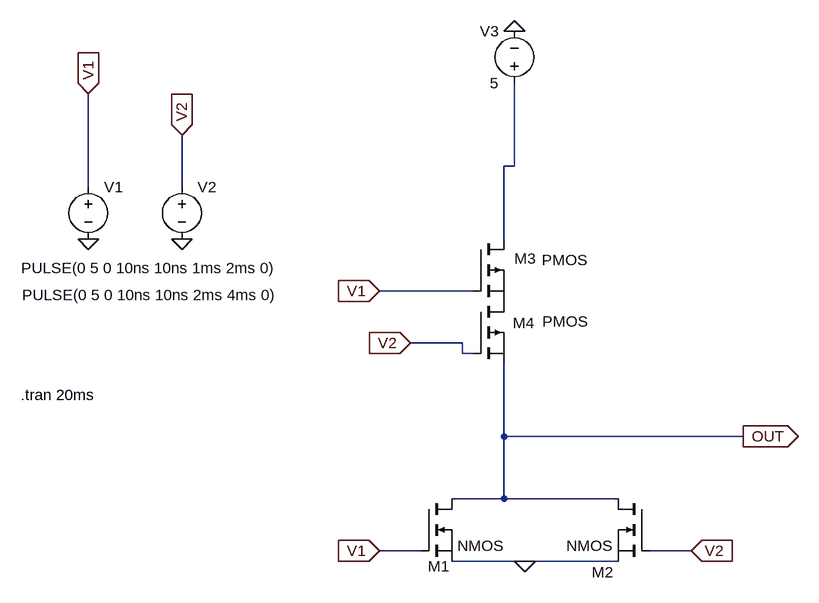
[diagram p0: schematic NOR.asc]
NOR.asc, the LTspice schematic file:
Version 4
SHEET 1 1348 992
WIRE 464 128 464 0
WIRE 464 128 448 128
WIRE -192 160 -192 16
WIRE -48 160 -48 80
WIRE 448 240 448 128
WIRE 400 320 256 320
WIRE 384 400 304 400
WIRE 384 416 384 400
WIRE 400 416 384 416
WIRE 448 544 448 432
WIRE 816 544 448 544
WIRE 448 640 448 544
WIRE 448 640 368 640
WIRE 624 640 448 640
WIRE 320 720 256 720
WIRE 736 720 672 720
WIRE 480 736 368 736
WIRE 624 736 480 736
FLAG -48 240 0
FLAG -192 240 0
FLAG 816 544 OUT
IOPIN 816 544 Out
FLAG -192 16 V1
IOPIN -192 16 In
FLAG 256 320 V1
IOPIN 256 320 In
FLAG -48 80 V2
IOPIN -48 80 In
FLAG 304 400 V2
IOPIN 304 400 In
FLAG 256 720 V1
IOPIN 256 720 In
FLAG 736 720 V2
IOPIN 736 720 In
FLAG 464 -80 0
FLAG 480 736 0
SYMBOL voltage -192 144 R0
WINDOW 3 -103 141 Left 2
WINDOW 123 0 0 Left 0
WINDOW 39 0 0 Left 0
SYMATTR Value PULSE(0 5 0 10ns 10ns 1ms 2ms 0)
SYMATTR InstName V1
SYMBOL voltage -48 144 R0
WINDOW 3 -246 182 Left 2
WINDOW 123 0 0 Left 0
WINDOW 39 0 0 Left 0
SYMATTR Value PULSE(0 5 0 10ns 10ns 2ms 4ms 0)
SYMATTR InstName V2
SYMBOL pmos 400 336 R0
WINDOW 0 -69 408 Left 2
WINDOW 3 107 31 Left 2
SYMATTR InstName M1
SYMBOL pmos 400 240 R0
WINDOW 0 183 513 Left 2
WINDOW 3 106 32 Left 2
SYMATTR InstName M2
SYMBOL voltage 464 16 R180
WINDOW 0 24 96 Left 2
WINDOW 3 24 16 Left 2
WINDOW 123 0 0 Left 0
WINDOW 39 0 0 Left 0
SYMATTR InstName V3
SYMATTR Value 5
SYMBOL nmos 320 640 R0
WINDOW 0 144 -370 Left 2
SYMATTR InstName M3
SYMBOL nmos 672 640 M0
WINDOW 0 177 -271 Left 2
SYMATTR InstName M4
TEXT -296 480 Left 2 !.tran 20ms

The netlist it stands for:
* NOR.asc
V1 V1 0 PULSE(0 5 0 10ns 10ns 1ms 2ms 0)
V2 V2 0 PULSE(0 5 0 10ns 10ns 2ms 4ms 0)
M1 P001 V2 OUT OUT PMOS
M2 N001 V1 P001 P001 PMOS
V3 N001 0 5
M3 OUT V1 0 0 NMOS
M4 OUT V2 0 0 NMOS
.model NMOS NMOS
.model PMOS PMOS
.lib standard.mos
.tran 20ms
.backanno
.end